# Altium schematic sheet current_mirror.SchDoc
size A4; Revision: 1; SheetNumber: 3; SheetTotal: 5
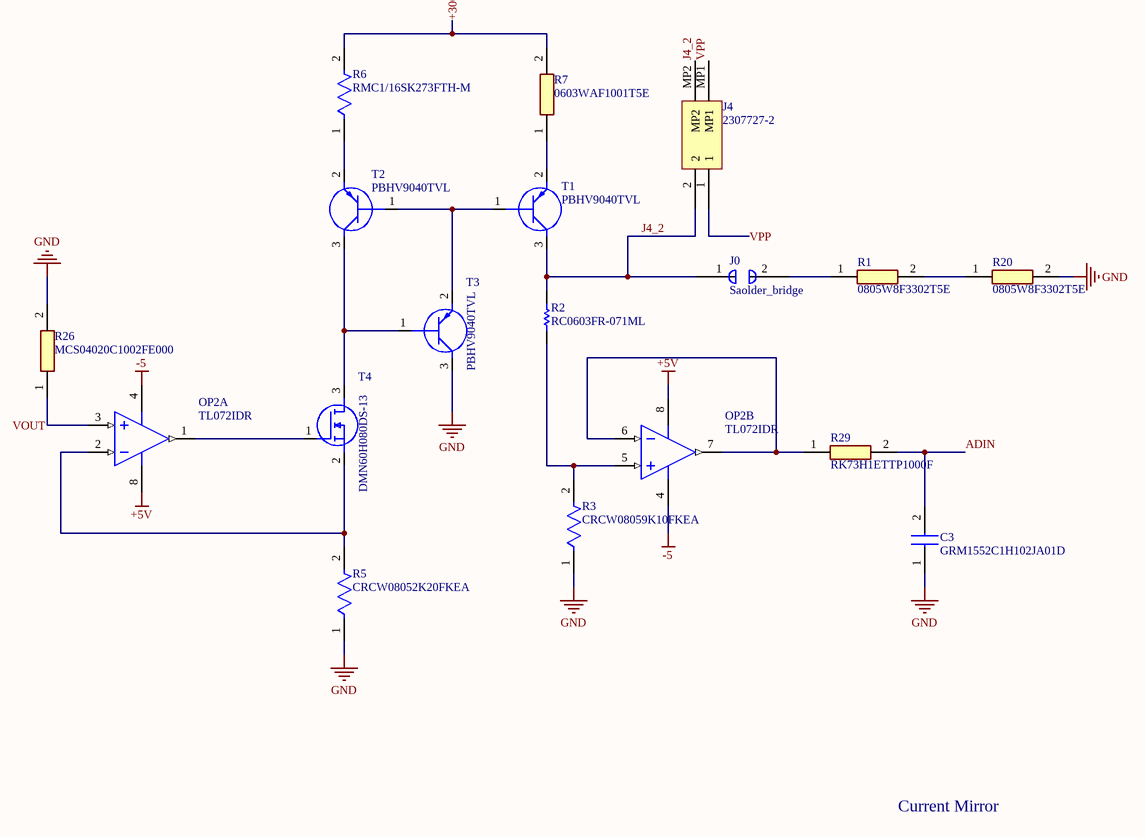
[diagram p0: current_mirror.SchDoc]

## Parts
C3  GRM1552C1H102JA01D  [CAPC1005X70N]
J0  Saolder_bridge  [Solder Bridge]
J4  2307727-2  [2307727-2]
OP2  TL072IDR  [D0008A_L]  (parts A,B of 2)
R1  0805W8F3302T5E  [RESC2013X65N]
R2  RC0603FR-071ML  [RESC1608X55X25LL10T15]
R3  CRCW08059K10FKEA  [FP-CRCW0805-e3-IPC_C]
R5  CRCW08052K20FKEA  [FP-CRCW0805-e3-IPC_B]
R6  RMC1/16SK273FTH-M  [FP-CRCW0402-e3-IPC_A]
R7  0603WAF1001T5E  [RESC1608X55N]
R20  0805W8F3302T5E  [RESC2013X65N]
R26  MCS04020C1002FE000  [RESC1005X37N]
R29  RK73H1ETTP1000F  [RESC1005X40N]
T1  PBHV9040TVL  [SOT95P230X110-3N]
T2  PBHV9040TVL  [SOT95P230X110-3N]
T3  PBHV9040TVL  [SOT95P230X110-3N]
T4  DMN60H080DS-13  [SOT96P240X110-3N]

## Nets
+5V: OP2.8(VCC+)
-5: OP2.4(VCC-)
GND: C3.1 R3.1 R5.1 R20.2 R26.2 T3.3(C)
+300V: R6.2 R7.2
ADIN: C3.2 R29.2
J4_2: J0.1 J4.2 J4.MP2 R2.2 T1.3(C)
VOUT: OP2.3(IN1+) R26.1
VPP: J4.1 J4.MP1
NetJ0_2: J0.2 R1.1
NetOP2_1: OP2.1(OUT1) T4.1(G)
NetOP2_2: OP2.2(IN1-) R5.2 T4.2(S)
NetOP2_5: OP2.5(IN2+) R2.1 R3.2
NetOP2_6: OP2.6(IN2-) OP2.7(OUT2) R29.1
NetR1_2: R1.2 R20.1
NetR6_1: R6.1 T2.2(E)
NetR7_1: R7.1 T1.2(E)
NetT1_1: T1.1(B) T2.1(B) T3.2(E)
NetT2_3: T2.3(C) T3.1(B) T4.3(D)

## Notes on the sheet
- Current Mirror

## Library data of the parts
C3 = GRM1552C1H102JA01D: Capacitor; Manufacturer_Name: Murata Electronics; Datasheet Link: https://search.murata.co.jp/Ceramy/image/img/A01X/G101/ENG/GRM1552C1H102JA01-01A.pdf; Height: 0.7mm; Manufacturer_Part_Number: GRM1552C1H102JA01D; Mouser Part Number: N/A; Mouser Price/Stock: https://www.mouser.co.uk/ProductDetail/Murata-Electronics/GRM1552C1H102JA01D?qs=UOvNgVTuGCqGiG7fJ8%252BtBQ%3D%3D
J0 = Component_1
J4 = 2307727-2: Connector
OP2 = CMP-0015-00084-2: Dual Low-Noise JFET-Input General-Purpose Operational Amplifier, 7 to 36 V, -40 to 85 degC, 8-pin SOIC (D8), Green (RoHS & no Sb/Br); Manufacturer: Texas Instruments; Number of Channels: 2; Rating: Catalog; IIB(Max)(pA): 200; Total Supply Voltage(Max)(+5V is 5, +/-5V is 10): 36; Vio (25C)(Max)(mV): 6; Iq per channel(Max)(mA): 2.5; Offset Drift(Typ)(uV/C): 18; Total Supply Voltage(Min)(+5V is 5, +/-5V is 10): 7; CMRR(Min)(dB): 75; Slew Rate(Typ)(V/us): 13; Sub Family: General Purpose Amplifier, High Supply Voltage Amplifier (>=30V); GBW(Typ)(MHz): 3; Code_JEDEC: MS-012; Eco-Plan: Green (RoHS & no Sb/Br); Mounting Technology: Surface Mount; ComponentLink3Description: Package Specification; PackageReference: D0008A; ComponentLink2URL: http://www.ti.com/lit/ds/symlink/tl072.pdf; ComponentLink1Description: Manufacturer URL; ComponentLink3URL: http://www.ti.com/litv/pdf/msoi002j; ComponentLink2Description: Datasheet; DatasheetVersion: SLOS080J; ComponentLink1URL: http://www.ti.com/; PackageDescription: 8-Pin Plastic Small Outline, Body 4.9 x 3.9 mm, Pitch 1.27 mm; PackageVersion: 4040047-3/M, 06/2011; Vn at 1kHz(Typ)(nV/rtHz): 18; PartNumber: TL072IDR
R1 R20 = 0805W8F3302T5E: Resistor; Manufacturer_Name: UNI-ROYAL(Uniroyal Elec); Datasheet Link: https://datasheet.lcsc.com/lcsc/2110251830_UNI-ROYAL-Uniroyal-Elec-0805W8F3302T5E_C17633.pdf; Height: 0.65mm; Manufacturer_Part_Number: 0805W8F3302T5E
R2 = CMP-1659-00056-1: Chip Resistor, 1 MOhm, +/- 1%, 100 mW, -55 to 155 degC, 0603 (1608 Metric), RoHS, Tape and Reel; Voltage Rating (DC): 25 V; Tolerance: 20%; Case\Package: Radial; Capacitance: 1 mF; Min Operating Temperature: -40 degC; PackageDescription: 2-Pin Surface Mount Device, Body 1.6 x 0.8 mm; ComponentLink1Description: Manufacturer URL; Radiation Hardening: No; DatasheetVersion: Rev. 4, 02/2016; REACH SVHC: No SVHC; Length: 20 mm; Max Operating Temperature: 85 degC; Diameter: 10 mm; Packaging: Bulk; Package Quantity: 200; PackageReference: 0603; Mount: Through Hole; ComponentLink1URL: http://www.yageo.com/; ComponentLink2URL: http://www.yageo.com/documents/recent/PYu-RC_Group_51_RoHS_L_04.pdf; ComponentLink2Description: Datasheet; Width: 0 inch; Lead Pitch: 5 mm; RoHSCompliant: true; Voltage Rating: 25 V; Height: 20 mm
R3 = CMP-2001-04176-2: RES Thick Film, 9.1kΩ, 1%, 0.125W, 100ppm/°C, 0805; Max Power Dissipation: 125mW; Voltage Rating (DC): 150V; Resistance: 9.1kR; Max Operating Temperature: 155°C; Termination: SMD/SMT; Height: 0.45mm; Package Quantity: 10; Radiation Hardening: No; Features: Automotive AEC-Q200; Depth: 1.25mm; Lead Free: Lead Free; Composition: Thick Film; Case Code (Metric): 2012; Tolerance: 1%; Military Standard: Not; Min Operating Temperature: -55°C; Case/Package: 0805; Length: 2mm; Case Code (Imperial): 0805; Voltage Rating: 150V; Contact Plating: Tin; Packaging: Tape and Reel; Number of Terminations: 2; Power Rating: 125mW; Width: 0.049inch; Temperature Coefficient: 100ppm/°C; Weight: 0.000194oz
R5 = CMP-2001-03760-2: RES Thick Film, 2.2kΩ, 1%, 0.125W, 100ppm/°C, 0805; Voltage Rating (DC): 150V; Max Power Dissipation: 125mW; Resistance: 2.2kR; Case/Package: 0805; Width: 1.25mm; Voltage Rating: 150V; Composition: Thick Film; Power Rating: 125mW; Packaging: Tape and Reel; Min Operating Temperature: -55°C; Contact Plating: Tin; Tolerance: 1%; Military Standard: Not; Case Code (Metric): 2012; Radiation Hardening: No; Termination: SMD/SMT; Lead Free: Lead Free; Case Code (Imperial): 0805; Max Operating Temperature: 155°C; Depth: 1.25mm; Weight: 0.000194oz; Number of Terminations: 2; Length: 2mm; Package Quantity: 10; Temperature Coefficient: 100ppm/°C; Features: Automotive AEC-Q200; Height: 0.45mm
R6 = CMP-2002-08431-2: RES Thick Film, 27kΩ, 1%, 0.063W, 100ppm/°C, 0402; Resistance: 27kR; Power Rating: 63mW; Voltage Rating: 50V; Military Standard: Not; Height: 0.35mm; Packaging: Tape and Reel; Case/Package: 0402; Temperature Coefficient: 100ppm/°C; Composition: Thick Film; Mount: Surface Mount; Features: Automotive AEC-Q200; Tolerance: 1%; Contact Plating: Tin; Radiation Hardening: No; Depth: 0.5mm; Termination: SMD/SMT; Width: 0.02inch; Package Quantity: 10; Min Operating Temperature: -55°C; Case Code (Metric): 1005; Lead Free: Lead Free; Voltage Rating (DC): 50V; Max Operating Temperature: 155°C; Weight: 2.3E-05oz; Case Code (Imperial): 0402; Length: 1mm; Number of Terminations: 2; Max Power Dissipation: 63mW; Number of Pins: 2
R7 = 0603WAF1001T5E: Resistor; Manufacturer_Name: UNI-ROYAL(Uniroyal Elec); Datasheet Link: https://datasheet.lcsc.com/szlcsc/Uniroyal-Elec-0603WAF1001T5E_C21190.pdf; Height: 0.55mm; Manufacturer_Part_Number: 0603WAF1001T5E
R26 = MCS04020C1002FE000: Resistor; Manufacturer_Name: Vishay; Datasheet Link: http://www.vishay.com/docs/28705/mcx0x0xpro.pdf; Height: 0.37mm; Manufacturer_Part_Number: MCS04020C1002FE000; Mouser Part Number: 594-MCS04020C1002FE0; Mouser Price/Stock: https://www.mouser.co.uk/ProductDetail/Vishay-Beyschlag/MCS04020C1002FE000?qs=7ZE6F4QMOBZ3EZwk%252BYP9Dg%3D%3D; Arrow Part Number: MCS04020C1002FE000; Arrow Price/Stock: https://www.arrow.com/en/products/mcs04020c1002fe000/vishay?utm_currency=USD&region=nac
R29 = RK73H1ETTP1000F: Resistor; Manufacturer_Name: KOA Speer; Datasheet Link: http://www.koaspeer.com/catimages/Products/RK73-RT/RK73-RT.pdf; Height: 0.4mm; Manufacturer_Part_Number: RK73H1ETTP1000F; Mouser Part Number: 660-RK73H1ETTP1000F; Mouser Price/Stock: https://www.mouser.co.uk/ProductDetail/KOA-Speer/RK73H1ETTP1000F?qs=VhCg8p3QXBZstDOVIJ3D7A%3D%3D; Arrow Part Number: RK73H1ETTP1000F; Arrow Price/Stock: https://www.arrow.com/en/products/rk73h1ettp1000f/koa-speer-electronics?region=nac
T1-T3 = PBHV9040TVL: Transistor BJT PNP; Manufacturer_Name: Nexperia; Datasheet Link: https://assets.nexperia.com/documents/data-sheet/PBHV9040T.pdf; Height: 1.1mm; Manufacturer_Part_Number: PBHV9040TVL; Mouser Part Number: 771-PBHV9040TVL; Mouser Price/Stock: https://www.mouser.co.uk/ProductDetail/Nexperia/PBHV9040TVL?qs=PqoDHHvF64%252B9n13F%2FsjH6g%3D%3D
T4 = DMN60H080DS-13: MOSFET (N-Channel); Manufacturer_Name: Diodes Incorporated; Datasheet Link: https://www.diodes.com//assets/Datasheets/DMN60H080DS.pdf; Height: 1.1mm; Manufacturer_Part_Number: DMN60H080DS-13; Mouser Part Number: 621-DMN60H080DS-13; Mouser Price/Stock: https://www.mouser.co.uk/ProductDetail/Diodes-Incorporated/DMN60H080DS-13?qs=HXFqYaX1Q2wO6tm1AgR7Fw%3D%3D; Arrow Part Number: DMN60H080DS-13; Arrow Price/Stock: https://www.arrow.com/en/products/dmn60h080ds-13/diodes-incorporated